# Altium schematic sheet amplifier.SchDoc
size A4; SheetNumber: 2; SheetTotal: 5
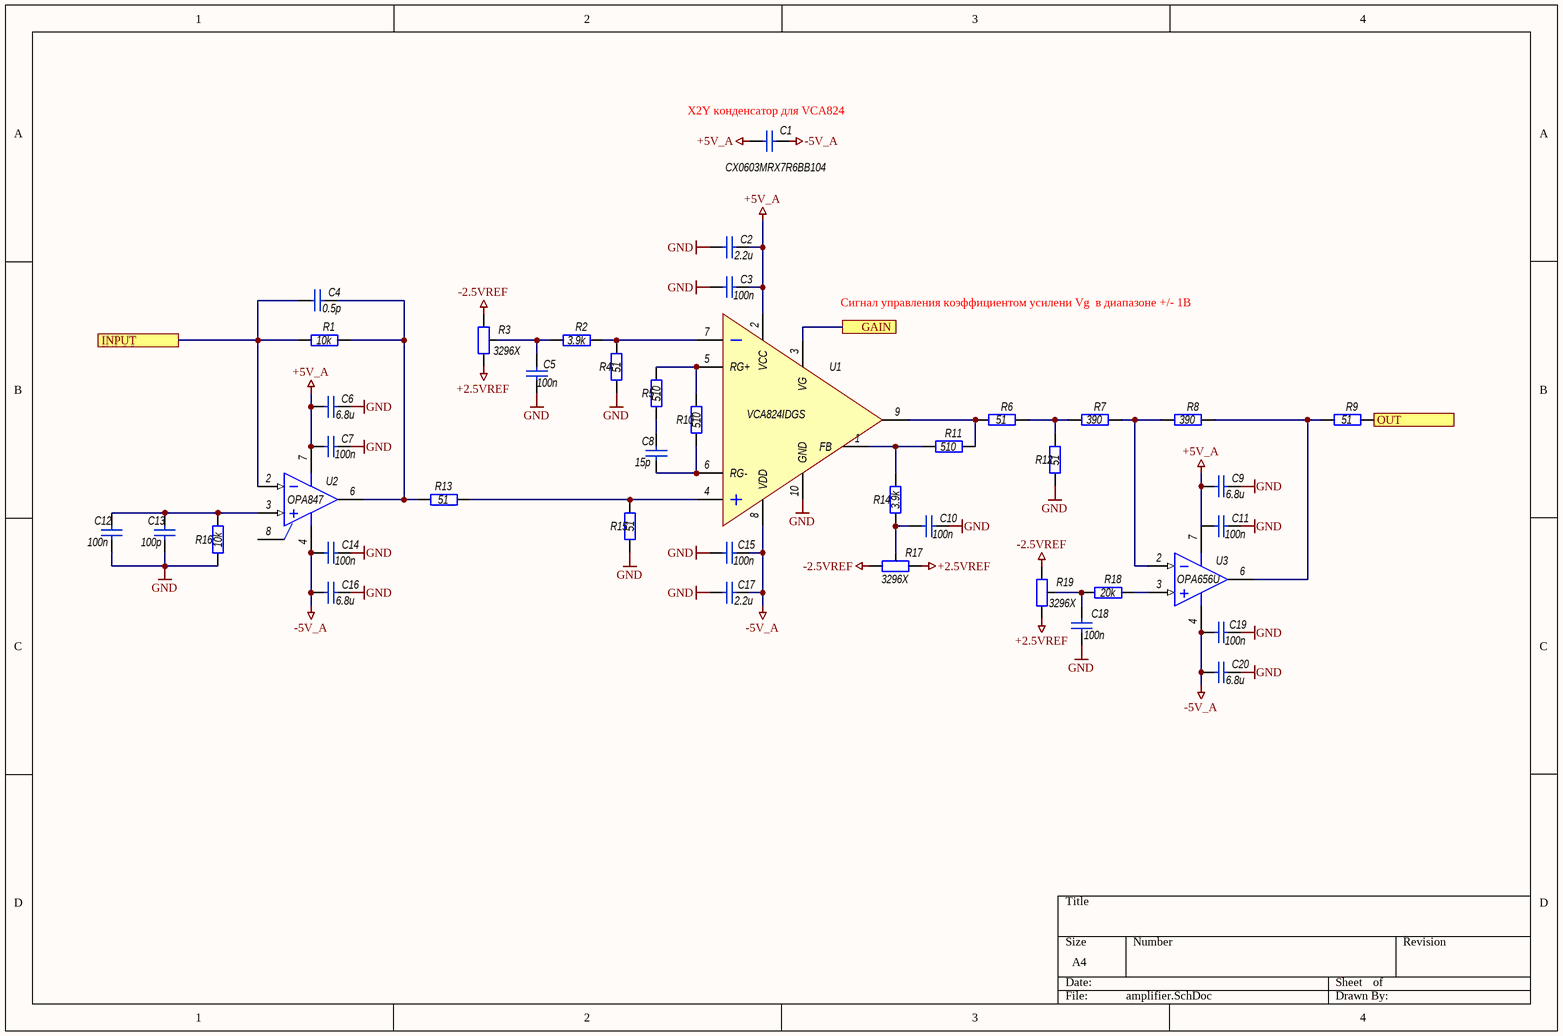
[diagram p0: amplifier.SchDoc]

## Parts
C1  CX0603MRX7R6BB104  [CAP_0603]
C2  2.2u  [CAP_0805]
C3  100n  [CAP_0603]
C4  0.5p  [CAP_0603]
C5  100n  [CAP_0603]
C6  6.8u  [CAP_0805]
C7  100n  [CAP_0603]
C8  15p  [CAP_0603]
C9  6.8u  [CAP_0805]
C10  100n  [CAP_0603]
C11  100n  [CAP_0603]
C12  100n  [CAP_0603]
C13  100p  [CAP_0603]
C14  100n  [CAP_0603]
C15  100n  [CAP_0603]
C16  6.8u  [CAP_0805]
C17  2.2u  [CAP_0805]
C18  100n  [CAP_0603]
C19  100n  [CAP_0603]
C20  6.8u  [CAP_0805]
R1  10k  [RES_0603]
R2  3.9k  [RES_0603]
R3  3296X  [3296X]
R4  51  [RES_0603]
R5  510  [RES_0603]
R6  51  [RES_0805]
R7  390  [RES_0603]
R8  390  [RES_0603]
R9  51  [RES_0805]
R10  510  [RES_0603]
R11  510  [RES_0603]
R12  51  [RES_0805]
R13  51  [RES_0805]
R14  3.9k  [RES_0603]
R15  51  [RES_0805]
R16  10k  [RES_0603]
R17  3296X  [3296X]
R18  20k  [RES_0603]
R19  3296X  [3296X]
U1  VCA824IDGS  [VSSOP10]
U2  OPA847  [SO8-150]
U3  OPA656U  [SO8-150]

## Ports
GAIN, INPUT, OUT

## Nets
+2.5VREF: R3.1 R17.1 R19.1
+5V_A: C1.1 C2.2 C3.2 C6.1 C7.1 C9.1 C11.1 U1.2(VCC) U2.7(V+) U3.7(V+)
-2.5VREF: R3.3 R17.3 R19.3
-5V_A: C1.2 C14.1 C15.2 C16.1 C17.2 C19.1 C20.1 U1.8(VDD) U2.4(V-) U3.4(V-)
GND: C2.1 C3.1 C5.2 C6.2 C7.2 C9.2 C10.2 C11.2 C12.1 C13.1 C14.2 C15.1 C16.2 C17.1 C18.2 C19.2 C20.2 R4.1 R12.1 R15.1 R16.1 U1.10(GND)
GAIN: U1.3(VG) ; port GAIN
INPUT: C4.1 R1.1 U2.2(IN-) ; port INPUT
OUT: R9.2 ; port OUT
NetC4_2: C4.2 R1.2 R13.1 U2.6(OUT)
NetC5_1: C5.1 R2.1 R3.2
NetC8_1: C8.1 R10.1 U1.6(RG-)
NetC8_2: C8.2 R5.1
NetC10_1: C10.1 R14.1 R17.2
NetC12_2: C12.2 C13.2 R16.2 U2.3(IN+)
NetC18_1: C18.1 R18.1 R19.2
NetR2_2: R2.2 R4.2 U1.7(RG)
NetR5_2: R5.2 R10.2 U1.5(RG+)
NetR6_1: R6.1 R11.2 U1.9(FB)
NetR6_2: R6.2 R7.1 R12.2
NetR7_2: R7.2 R8.1 U3.2(IN-)
NetR8_2: R8.2 R9.1 U3.6(OUT)
NetR11_1: R11.1 R14.2 U1.1(FB)
NetR13_2: R13.2 R15.2 U1.4(RG)
NetR18_2: R18.2 U3.3(IN+)

Not connected (* = marked no-connect by the designer): U2 8(RG)

## Notes on the sheet
- (near C1) X2Y конденсатор для VCA824
- (near U1) Сигнал управления коэффициентом усилени Vg  в диапазоне +/- 1В

## Library data of the parts
C1-C20 = Capacitor: Конденсатор
R1 R16 = Resisitor: Резистор; ValueBOM: 0805 10k 0.125; MarkPCB: 103; ValueSCH: 10k
R2 R4-R15 R18 = Resisitor: Резистор; ValueBOM: 0805 10k 0.125; ValueSCH: 10k; MarkPCB: 103
R3 R17 R19 = 3296X: Резистор подстроечный; ValueBOM: 3296X; ValueSCH: 3296X; HelpURL: C:\Datasheets\.pdf
U1 = VCA824 (VSOP10)
U2 = OPA847: Операционный усилитель; ValueBOM: OPA847; ValueSCH: OPA847; MarkPCB: OPA847; HelpURL: C:\Datasheets\OPA847.pdf
U3 = OPA657: Операционный усилитель; ValueBOM: OPA657; ValueSCH: OPA657; MarkPCB: OPA657; HelpURL: C:\Datasheets\OPA657.pdf